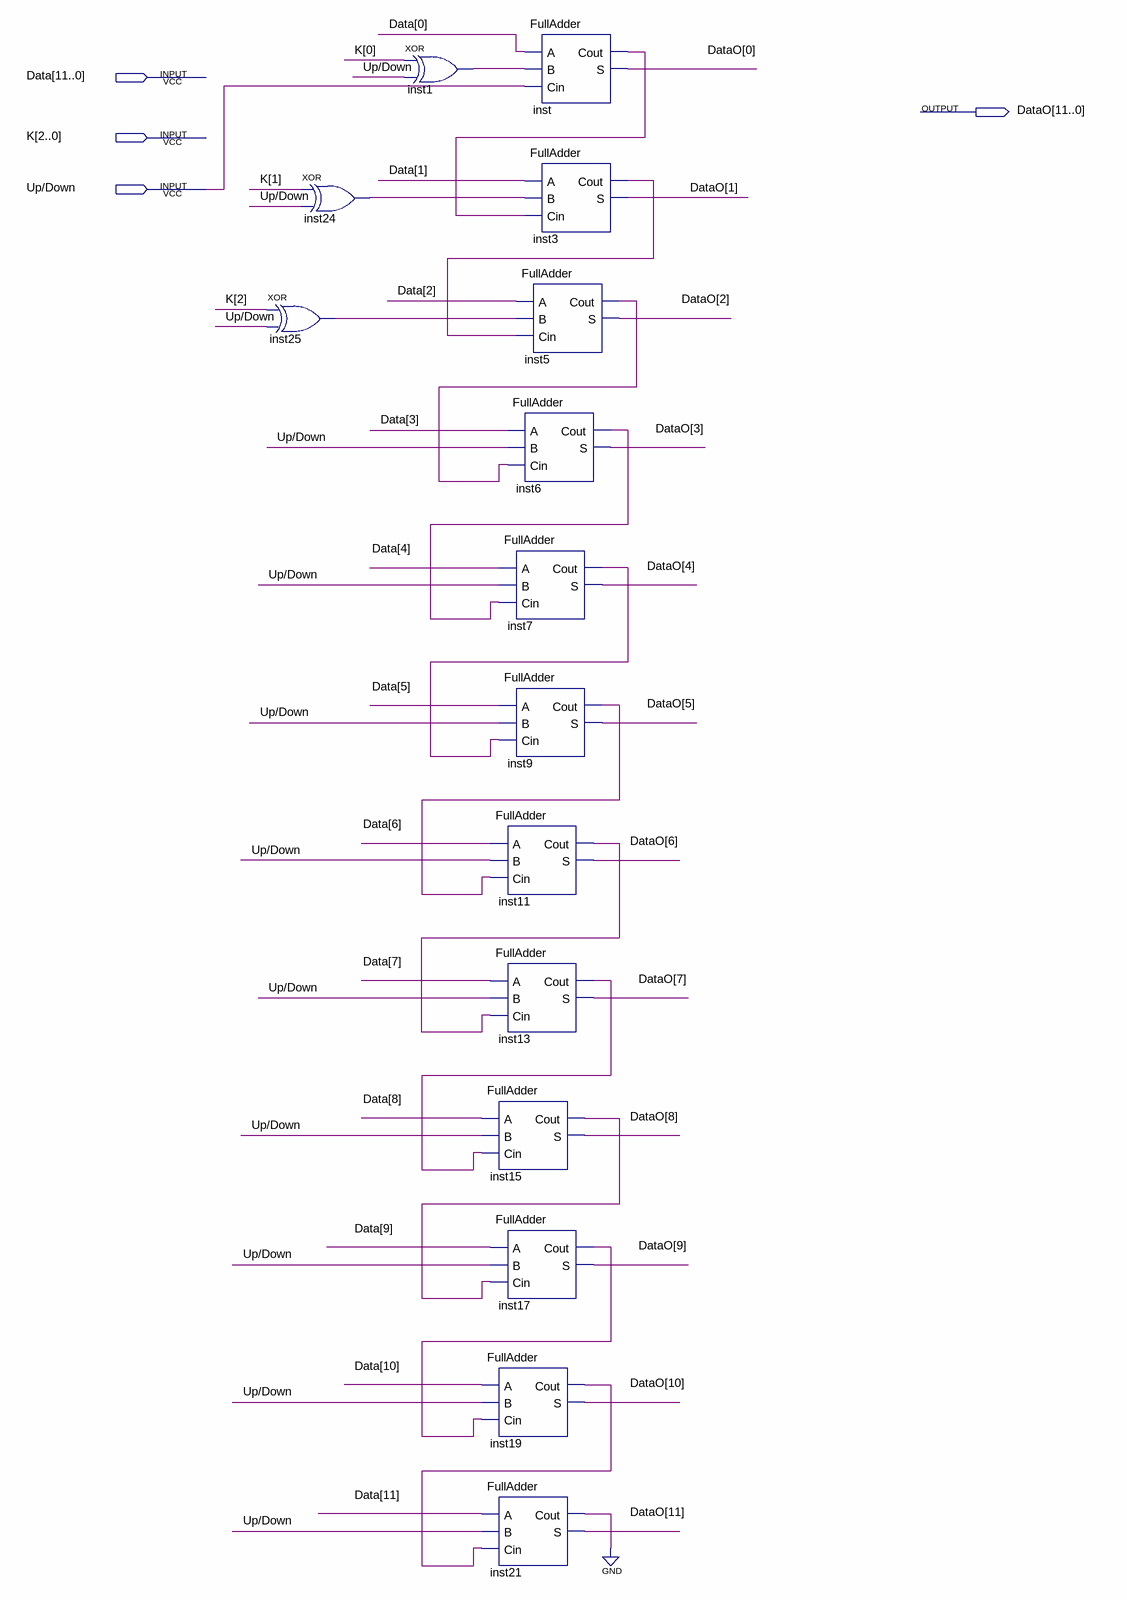
[diagram p0: schematic sheet]
// Quartus schematic sumadorBus11.bdf as structural Verilog: 15 symbols, 4 pins
module sumadorBus11 (
  input  [11:0] Data,
  input  [2:0] K,
  input  \Up/Down ,
  output [11:0] DataO
);

  wire inst1_out, inst3_cout, inst5_cout, inst6_cout, inst7_cout, inst9_cout, inst11_cout, inst13_cout,
       inst15_cout, inst17_cout, inst19_cout, inst21_cout, inst24_out, inst25_out, inst_cout;

  xor inst25 (inst25_out, K[2], \Up/Down );
  xor inst24 (inst24_out, K[1], \Up/Down );
  xor inst1 (inst1_out, K[0], \Up/Down );
  FullAdder inst15 (.A(Data[8]), .B(\Up/Down ), .Cin(inst13_cout), .Cout(inst15_cout), .S(DataO[8]));
  FullAdder inst19 (.A(Data[10]), .B(\Up/Down ), .Cin(inst17_cout), .Cout(inst19_cout), .S(DataO[10]));
  FullAdder inst21 (.A(Data[11]), .B(\Up/Down ), .Cin(inst19_cout), .Cout(inst21_cout), .S(DataO[11]));
  FullAdder inst (.A(Data[0]), .B(inst1_out), .Cin(\Up/Down ), .Cout(inst_cout), .S(DataO[0]));
  FullAdder inst3 (.A(Data[1]), .B(inst24_out), .Cin(inst_cout), .Cout(inst3_cout), .S(DataO[1]));
  FullAdder inst5 (.A(Data[2]), .B(inst25_out), .Cin(inst3_cout), .Cout(inst5_cout), .S(DataO[2]));
  FullAdder inst6 (.A(Data[3]), .B(\Up/Down ), .Cin(inst5_cout), .Cout(inst6_cout), .S(DataO[3]));
  FullAdder inst7 (.A(Data[4]), .B(\Up/Down ), .Cin(inst6_cout), .Cout(inst7_cout), .S(DataO[4]));
  FullAdder inst9 (.A(Data[5]), .B(\Up/Down ), .Cin(inst7_cout), .Cout(inst9_cout), .S(DataO[5]));
  FullAdder inst11 (.A(Data[6]), .B(\Up/Down ), .Cin(inst9_cout), .Cout(inst11_cout), .S(DataO[6]));
  FullAdder inst13 (.A(Data[7]), .B(\Up/Down ), .Cin(inst11_cout), .Cout(inst13_cout), .S(DataO[7]));
  FullAdder inst17 (.A(Data[9]), .B(\Up/Down ), .Cin(inst15_cout), .Cout(inst17_cout), .S(DataO[9]));
  // also tied to GND on the sheet: inst21_cout
endmodule
